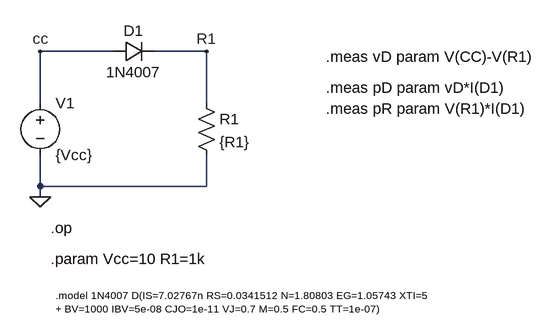
[diagram p0: schematic LAB01a.asc]
LAB01a.asc, the LTspice schematic file:
Version 4
SHEET 1 880 680
WIRE 80 32 -32 32
WIRE 224 32 144 32
WIRE -32 112 -32 32
WIRE 224 112 224 32
WIRE -32 240 -32 192
WIRE 224 240 224 192
WIRE 224 240 -32 240
WIRE -32 256 -32 240
FLAG -32 256 0
FLAG 224 32 R1
FLAG -32 32 cc
SYMBOL voltage -32 96 R0
WINDOW 123 0 0 Left 0
WINDOW 39 0 0 Left 0
SYMATTR InstName V1
SYMATTR Value {Vcc}
SYMBOL res 208 96 R0
SYMATTR InstName R1
SYMATTR Value {R1}
SYMBOL diode 80 48 R270
WINDOW 0 32 32 VTop 2
WINDOW 3 0 32 VBottom 2
SYMATTR InstName D1
SYMATTR Value 1N4007
TEXT -16 304 Left 2 !.op
TEXT -16 352 Left 2 !.param Vcc=10 R1=1k
TEXT 408 40 Left 2 !.meas vD param V(CC)-V(R1)
TEXT 408 88 Left 2 !.meas pD param vD*I(D1)
TEXT 408 120 Left 2 !.meas pR param V(R1)*I(D1)
TEXT -8 408 Left 1 !.model 1N4007 D(IS=7.02767n RS=0.0341512 N=1.80803 EG=1.05743 XTI=5 \n+ BV=1000 IBV=5e-08 CJO=1e-11 VJ=0.7 M=0.5 FC=0.5 TT=1e-07)

The netlist it stands for:
* LAB01a.asc
V1 cc 0 {Vcc}
R1 R1 0 {R1}
D1 cc R1 1N4007
.model D D
.lib standard.dio
.op
.param Vcc=10 R1=1k
.meas vD param V(CC)-V(R1)
.meas pD param vD*I(D1)
.meas pR param V(R1)*I(D1)
.model 1N4007 D(IS=7.02767n RS=0.0341512 N=1.80803 EG=1.05743 XTI=5
+ BV=1000 IBV=5e-08 CJO=1e-11 VJ=0.7 M=0.5 FC=0.5 TT=1e-07)
.backanno
.end